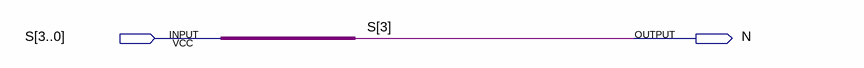
[diagram p0: schematic sheet]
// Quartus schematic BloqueN.bdf as structural Verilog: 0 symbols, 2 pins
module BloqueN (
  input  [3:0] S,
  output N
);


  assign N = S[3];
endmodule
